# Altium schematic sheet Jack_3.5mm.SchDoc
size A4
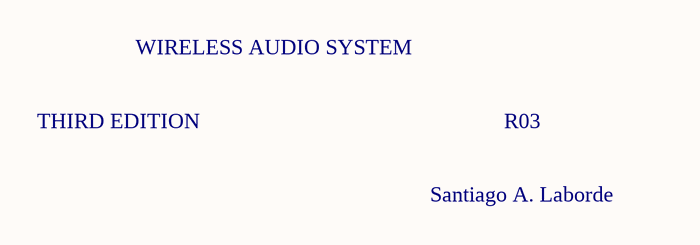
[diagram p0: Jack_3.5mm.SchDoc]

## Notes on the sheet
- WIRELESS AUDIO SYSTEM
- THIRD EDITION
- R03
- Santiago A. Laborde